# Altium project C8T6.PrjPcb
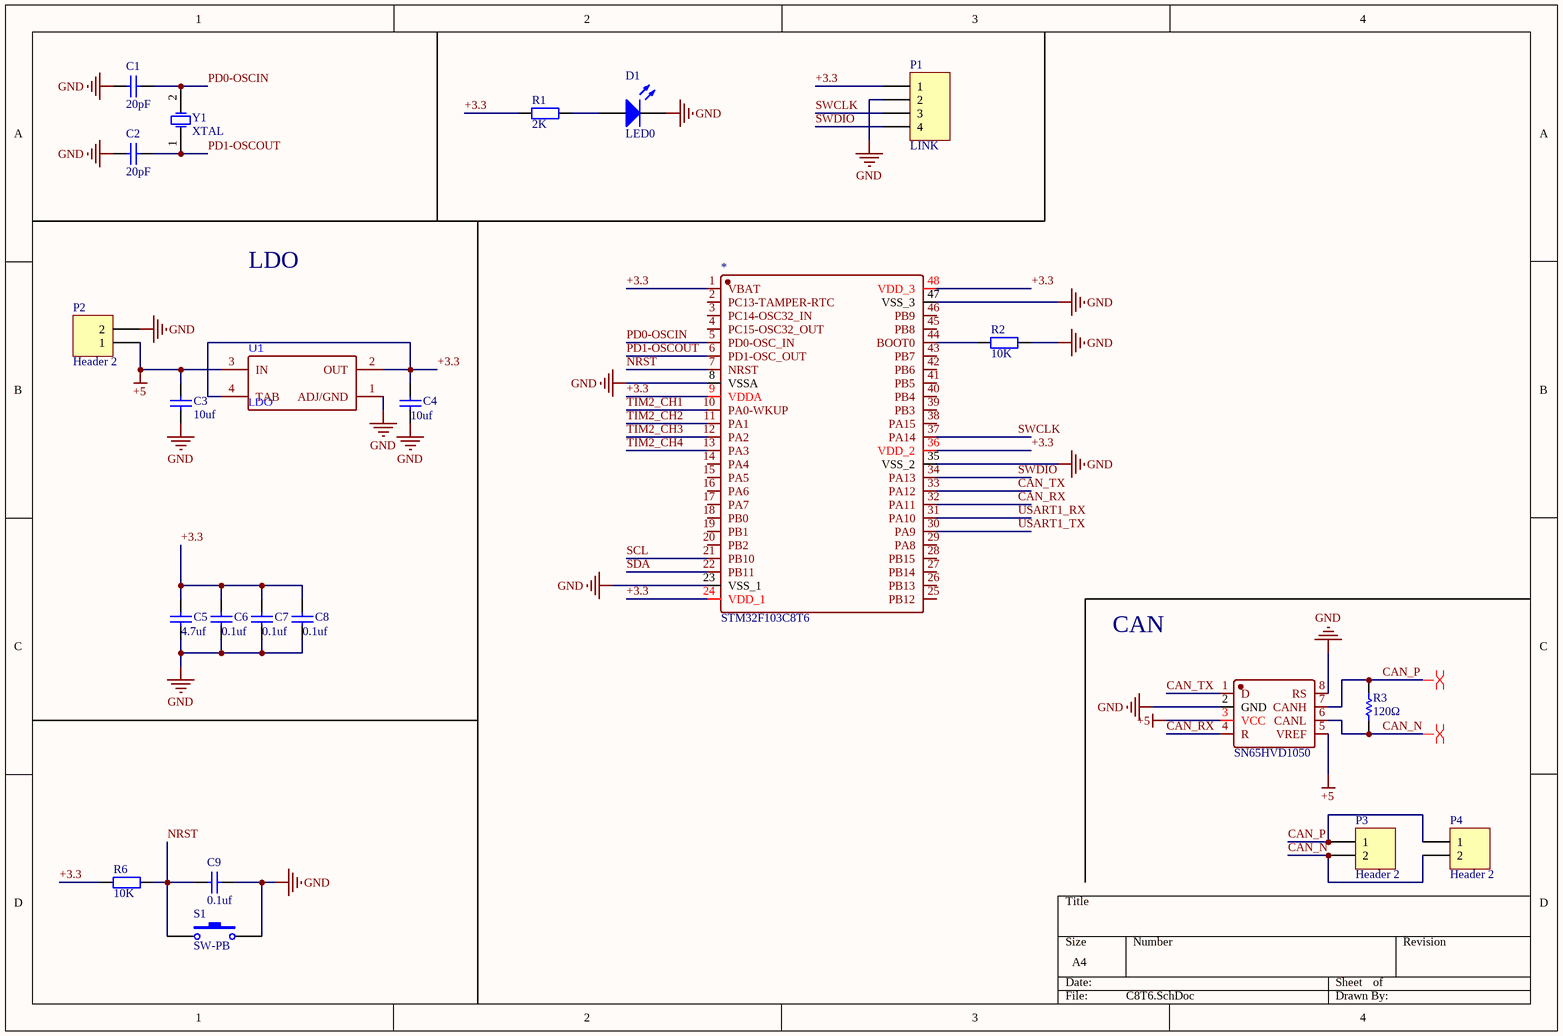
[diagram p0: C8T6.SchDoc]
1 sheet, 23 parts. Net scope: global (net labels, ports and power ports of the same name join across sheets).
Board file: C8T6.PcbDoc

## Sheet C8T6.SchDoc
size A4; SheetNumber: 1; SheetTotal: 1

### Parts
3  STM32F103C8T6  [STM32F103C8T6]
*  SN65HVD1050  [SN65HVD230DR]
C1  20pF  [CAP0603]
C2  20pF  [CAP0603]
C3  10uf  [cap0402]
C4  10uf  [CASE-X-7343]
C5  4.7uf  [cap0402]
C6  0.1uf  [cap0402]
C7  0.1uf  [cap0402]
C8  0.1uf  [cap0402]
C9  0.1uf  [cap0402]
D1  LED0  [LED-0603]
P1  LINK  [GH1.25-49]
P2  Header 2  [XT30-M]
P3  Header 2  [CONN-SMD_GH1.25-2PWBPZ]
P4  Header 2  [CONN-SMD_GH1.25-2PWBPZ]
R1  2K  [res0402]
R2  10K  [res0402]
R3  120Ω  [cap0402]
R6  10K  [res0402]
S1  SW-PB  [SW-SMD_4P-L4.5-W4.5-P3.00-LS6.8]
U1  LDO  [SOT-223-3_L6.5-W3.4-P2.30-LS7.0-BR]
Y1  XTAL  [OSC-SMD_4P-L3.2-W2.5-BL]

### Nets
+5: *.3(VCC) *.5(VREF) C3.2 P2.1 U1.3(IN)
GND: 3.8(VSSA) 3.23(VSS_1) 3.35(VSS_2) 3.47(VSS_3) *.2(GND) *.8(RS) C1.1 C2.1 C3.1 C4.1 C5.1 C6.1 C7.1 C8.1 C9.2 D1.2(K) P1.2 P2.2 R2.2 S1.2 U1.1(ADJ/GND)
+3.3: 3.1(VBAT) 3.9(VDDA) 3.24(VDD_1) 3.36(VDD_2) 3.48(VDD_3) C4.2 C5.2 C6.2 C7.2 C8.2 P1.1 R1.1 R6.1 U1.2(OUT) U1.4(TAB)
CAN_N: *.6(CANL) P3.2 P4.2 R3.2
CAN_P: *.7(CANH) P3.1 P4.1 R3.1
CAN_RX: 3.32(PA11) *.4(R)
CAN_TX: 3.33(PA12) *.1(D)
NRST: 3.7(NRST) C9.1 R6.2 S1.1
PD0-OSCIN: 3.5(PD0-OSC_IN) C1.2 Y1.2(OSC2)
PD1-OSCOUT: 3.6(PD1-OSC_OUT) C2.2 Y1.1(OSC1)
SCL: 3.21(PB10)
SDA: 3.22(PB11)
SWCLK: 3.37(PA14) P1.3
SWDIO: 3.34(PA13) P1.4
TIM2_CH1: 3.10(PA0-WKUP)
TIM2_CH2: 3.11(PA1)
TIM2_CH3: 3.12(PA2)
TIM2_CH4: 3.13(PA3)
USART1_RX: 3.31(PA10)
USART1_TX: 3.30(PA9)
Net3_44: 3.44(BOOT0) R2.1
NetD1_1: D1.1(A) R1.2

Not connected (* = marked no-connect by the designer): 3 2(PC13-TAMPER-RTC) 3(PC14-OSC32_IN) 4(PC15-OSC32_OUT) 14(PA4) 15(PA5) 16(PA6) 17(PA7) 18(PB0) 19(PB1) 20(PB2) 25(PB12) 26(PB13) 27(PB14) 28(PB15) 29(PA8) 38(PA15) 39(PB3) 40(PB4) 41(PB5) 42(PB6) 43(PB7) 45(PB8) 46(PB9)

### Layout directives
differential pair: CAN_N, CAN_P

### Notes on the sheet
- LDO
- CAN

### Library data of the parts
* = SN65HVD230DR
C1-C3 = Cap: 0603; Published: 8-Jun-2000; LatestRevisionDate: 17-Jul-2002; LatestRevisionNote: Re-released for DXP Platform.; PackageReference: RAD-0.3; Publisher: Altium Limited; PackageDescription: Radial Cap, Thru-Hole; 2 Leads; 0.3 in Pin Spacing
C4 = Cap: 钽电容; Published: 8-Jun-2000; LatestRevisionDate: 17-Jul-2002; LatestRevisionNote: Re-released for DXP Platform.; PackageReference: RAD-0.3; Publisher: Altium Limited; PackageDescription: Radial Cap, Thru-Hole; 2 Leads; 0.3 in Pin Spacing
C5-C9 = Cap: 0402; Published: 8-Jun-2000; LatestRevisionDate: 17-Jul-2002; LatestRevisionNote: Re-released for DXP Platform.; PackageReference: RAD-0.3; Publisher: Altium Limited; PackageDescription: Radial Cap, Thru-Hole; 2 Leads; 0.3 in Pin Spacing
D1 = LED0: Typical INFRARED GaAs LED; Published: 8-Jun-2000; LatestRevisionDate: 08-Jul-2005; LatestRevisionNote: Mech Layer 1 removed.; PackageReference: LED-0; Publisher: Altium Limited; PackageDescription: LED; 2 Leads
P1 = Header 4: Header, 4-Pin; LatestRevisionDate: 17-Jul-2002; LatestRevisionNote: Re-released for DXP Platform.; Publisher: Altium Limited
P2-P4 = Header 2: Header, 2-Pin; LatestRevisionDate: 17-Jul-2002; LatestRevisionNote: Re-released for DXP Platform.; Publisher: Altium Limited
R1 R2 R6 = Res2: 0402; Published: 8-Jun-2000; LatestRevisionDate: 17-Jul-2002; LatestRevisionNote: Re-released for DXP Platform.; PackageReference: AXIAL-0.4; Publisher: Altium Limited; PackageDescription: Axial Device, Thru-Hole; 2 Leads; 0.4 in Pin Spacing
R3 = Res1: 0402; Published: 8-Jun-2000; LatestRevisionDate: 17-Jul-2002; LatestRevisionNote: Re-released for DXP Platform.; PackageReference: AXIAL-0.3; Publisher: Altium Limited; PackageDescription: Axial Device, Thru-Hole; 2 Leads; 0.3 in Pin Spacing
S1 = SW-PB: Switch; Published: 24-Mar-1999; LatestRevisionDate: 17-Jul-2002; LatestRevisionNote: Re-released for DXP Platform.; PackageReference: SPST-2; Publisher: Altium Limited; PackageDescription: Switch; 2 Leads
U1 = LM1117S-3.3: SOT-223
Y1 = XTAL: ECS-240-12-33Q-JES-TR; Published: 8-Jun-2000; LatestRevisionDate: 17-Jul-2002; LatestRevisionNote: Re-released for DXP Platform.; PackageReference: R38; Publisher: Altium Limited; PackageDescription: Crystal, Thru-Hole; 2 Leads; Body 3.1 x 8.2 mm (Dia.xH)